# Altium schematic sheet barcode_scanner.SchDoc
size 297 x 209 mm; DrawnBy: Supun; Engineer: Supun; Organization: C3
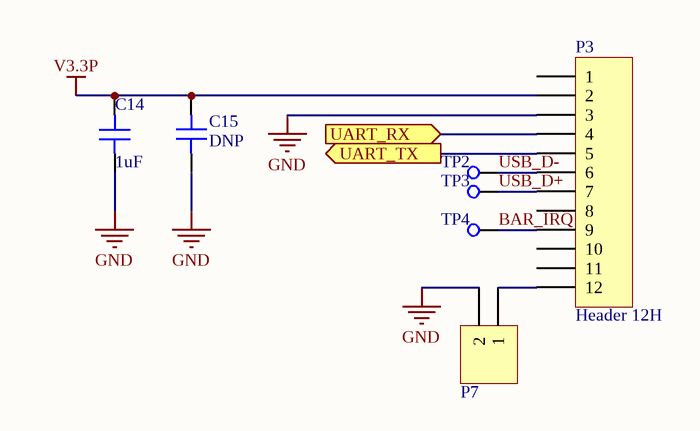
[diagram p0: barcode_scanner.SchDoc]

## Parts
C14  1uF  [CAP 0603_1608]
C15  DNP  [CAP 0603_1608]
P3  Header 12H  [Amphenol_FFC/FPC_12_0.5mm]
P7  DNP  [HDR1X2]  (value not drawn)
TP2  Test Point  [TPSMD_S1]  (value not drawn)
TP3  Test Point  [TPSMD_S1]  (value not drawn)
TP4  Test Point  [TPSMD_S1]  (value not drawn)

## Ports
UART_RX (in), UART_TX (out)

## Nets
GND: C14.1 C15.2 P3.3 P7.2
V3.3P: C14.2 C15.1 P3.2
BAR_IRQ: P3.9 TP4.1(TP)
UART_RX: P3.4 ; port UART_RX
UART_TX: P3.5 ; port UART_TX
USB_D+: P3.7 TP3.1(TP)
USB_D-: P3.6 TP2.1(TP)
NetP3_12: P3.12 P7.1

Not connected (* = marked no-connect by the designer): P3 1 8 10 11

## Notes on the sheet
- Title
- Size:
- Date:
- A4
- Number:
- Time:
- Revision:
- Sheet
- of
- File:

## Library data of the parts
C14 = Capacitor: SMT Capacitor; MF: Murata; MP: GRT188R61H105KE13D; Value: 1uF; Link: https://www.mouser.com/ProductDetail/Murata-Electronics/GRT188R61H105KE13D?qs=drgMNd%252BkGPNIxxtJByMGCg%3D%3D
C15 = Capacitor: SMT Capacitor; Value: DNP; Link: https://
P3 = Header 12H: Header, 12-Pin, Right Angle; MF: Amphenol; MP: 10051922-1210ELF; LatestRevisionDate: 17-Jul-2002; LatestRevisionNote: Re-released for DXP Platform.; Publisher: Altium Limited; Value: *
P7 = Header 2: Header, 2-Pin; LatestRevisionDate: 17-Jul-2002; LatestRevisionNote: Re-released for DXP Platform.; Publisher: Altium Limited; Value: DNP
TP2-TP4 = Test Point: Link: https://